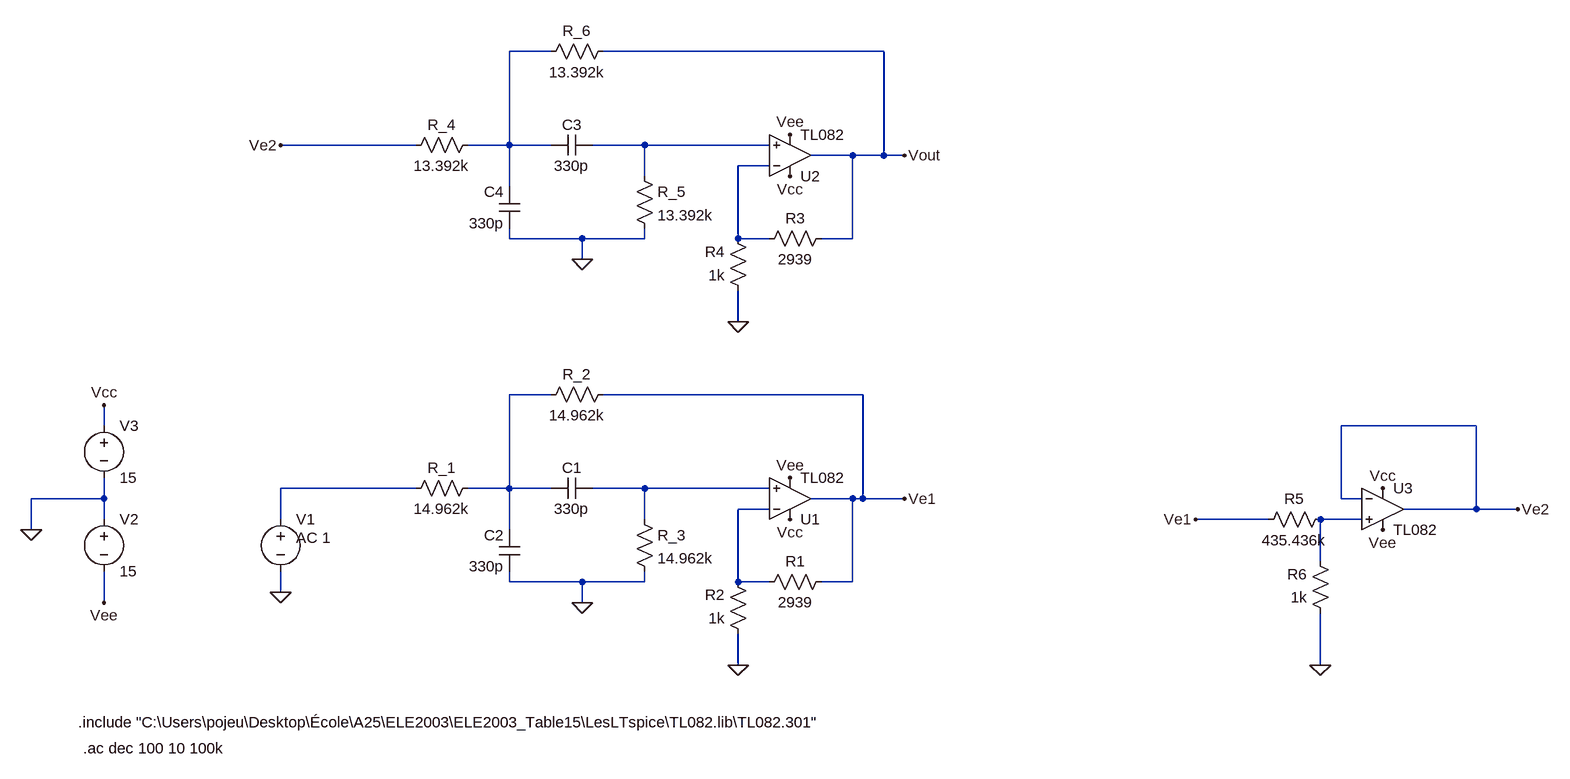
[diagram p0: schematic 2Passe-Bande.asc]
2Passe-Bande.asc, the LTspice schematic file:
Version 4.1
SHEET 1 1836 680
WIRE 288 -800 224 -800
WIRE 800 -800 368 -800
WIRE 80 -656 -128 -656
WIRE 224 -656 224 -800
WIRE 224 -656 160 -656
WIRE 288 -656 224 -656
WIRE 432 -656 352 -656
WIRE 624 -656 432 -656
WIRE 752 -640 688 -640
WIRE 800 -640 800 -800
WIRE 800 -640 752 -640
WIRE 832 -640 800 -640
WIRE 624 -624 576 -624
WIRE 432 -608 432 -656
WIRE 224 -592 224 -656
WIRE 224 -512 224 -528
WIRE 336 -512 224 -512
WIRE 432 -512 432 -528
WIRE 432 -512 336 -512
WIRE 576 -512 576 -624
WIRE 624 -512 576 -512
WIRE 752 -512 752 -640
WIRE 752 -512 704 -512
WIRE 336 -480 336 -512
WIRE 576 -384 576 -432
WIRE 288 -272 224 -272
WIRE 768 -272 368 -272
WIRE -400 -224 -400 -256
WIRE 1712 -224 1504 -224
WIRE 80 -128 -128 -128
WIRE 224 -128 224 -272
WIRE 224 -128 160 -128
WIRE 288 -128 224 -128
WIRE 432 -128 352 -128
WIRE 624 -128 432 -128
WIRE -400 -112 -400 -144
WIRE -400 -112 -512 -112
WIRE 752 -112 688 -112
WIRE 768 -112 768 -272
WIRE 768 -112 752 -112
WIRE 832 -112 768 -112
WIRE 1504 -112 1504 -224
WIRE 1536 -112 1504 -112
WIRE 624 -96 576 -96
WIRE 1712 -96 1712 -224
WIRE 1712 -96 1600 -96
WIRE 1776 -96 1712 -96
WIRE -400 -80 -400 -112
WIRE -128 -80 -128 -128
WIRE 432 -80 432 -128
WIRE 1392 -80 1280 -80
WIRE 1536 -80 1472 -80
WIRE -512 -64 -512 -112
WIRE 224 -64 224 -128
WIRE 1472 -16 1472 -80
WIRE 224 16 224 0
WIRE 336 16 224 16
WIRE 432 16 432 0
WIRE 432 16 336 16
WIRE 576 16 576 -96
WIRE 624 16 576 16
WIRE 752 16 752 -112
WIRE 752 16 704 16
WIRE -128 32 -128 0
WIRE -400 48 -400 0
WIRE 336 48 336 16
WIRE 576 144 576 96
WIRE 1472 144 1472 64
FLAG -128 32 0
FLAG 336 48 0
FLAG 576 144 0
FLAG -512 -64 0
FLAG 656 -144 Vee
FLAG -400 48 Vee
FLAG -400 -256 Vcc
FLAG 656 -80 Vcc
FLAG 336 -480 0
FLAG 576 -384 0
FLAG 656 -672 Vee
FLAG 656 -608 Vcc
FLAG 1472 144 0
FLAG 1568 -64 Vee
FLAG 1568 -128 Vcc
FLAG 832 -640 Vout
FLAG 1280 -80 Ve1
FLAG 1776 -96 Ve2
FLAG -128 -656 Ve2
FLAG 832 -112 Ve1
SYMBOL voltage -128 -96 R0
WINDOW 123 24 44 Left 2
WINDOW 39 0 0 Left 0
SYMATTR InstName V1
SYMATTR Value ""
SYMATTR Value2 AC 1
SYMBOL res 176 -144 R90
WINDOW 0 0 56 VBottom 2
WINDOW 3 32 56 VTop 2
SYMATTR InstName R_1
SYMATTR Value 14.962k
SYMBOL cap 352 -144 R90
WINDOW 0 0 32 VBottom 2
WINDOW 3 32 32 VTop 2
SYMATTR InstName C1
SYMATTR Value 330p
SYMBOL cap 240 0 R180
WINDOW 0 24 56 Left 2
WINDOW 3 24 8 Left 2
SYMATTR InstName C2
SYMATTR Value 330p
SYMBOL res 416 -96 R0
SYMATTR InstName R_3
SYMATTR Value 14.962k
SYMBOL res 384 -288 R90
WINDOW 0 0 56 VBottom 2
WINDOW 3 32 56 VTop 2
SYMATTR InstName R_2
SYMATTR Value 14.962k
SYMBOL OpAmps\\opamp2 656 -48 M180
SYMATTR InstName U1
SYMATTR Value TL082
SYMBOL voltage -400 -96 R0
SYMATTR InstName V2
SYMATTR Value 15
SYMBOL voltage -400 -240 R0
SYMATTR InstName V3
SYMATTR Value 15
SYMBOL res 720 0 R90
WINDOW 0 0 56 VBottom 2
WINDOW 3 32 56 VTop 2
SYMATTR InstName R1
SYMATTR Value 2939
SYMBOL res 592 112 R180
WINDOW 0 36 76 Left 2
WINDOW 3 36 40 Left 2
SYMATTR InstName R2
SYMATTR Value 1k
SYMBOL res 176 -672 R90
WINDOW 0 0 56 VBottom 2
WINDOW 3 32 56 VTop 2
SYMATTR InstName R_4
SYMATTR Value 13.392k
SYMBOL cap 352 -672 R90
WINDOW 0 0 32 VBottom 2
WINDOW 3 32 32 VTop 2
SYMATTR InstName C3
SYMATTR Value 330p
SYMBOL cap 240 -528 R180
WINDOW 0 24 56 Left 2
WINDOW 3 24 8 Left 2
SYMATTR InstName C4
SYMATTR Value 330p
SYMBOL res 416 -624 R0
SYMATTR InstName R_5
SYMATTR Value 13.392k
SYMBOL res 384 -816 R90
WINDOW 0 0 56 VBottom 2
WINDOW 3 32 56 VTop 2
SYMATTR InstName R_6
SYMATTR Value 13.392k
SYMBOL OpAmps\\opamp2 656 -576 M180
SYMATTR InstName U2
SYMATTR Value TL082
SYMBOL res 720 -528 R90
WINDOW 0 0 56 VBottom 2
WINDOW 3 32 56 VTop 2
SYMATTR InstName R3
SYMATTR Value 2939
SYMBOL res 592 -416 R180
WINDOW 0 36 76 Left 2
WINDOW 3 36 40 Left 2
SYMATTR InstName R4
SYMATTR Value 1k
SYMBOL res 1488 -96 R90
WINDOW 0 0 56 VBottom 2
WINDOW 3 32 56 VTop 2
SYMATTR InstName R5
SYMATTR Value 435.436k
SYMBOL res 1488 80 R180
WINDOW 0 36 76 Left 2
WINDOW 3 36 40 Left 2
SYMATTR InstName R6
SYMATTR Value 1k
SYMBOL OpAmps\\opamp2 1568 -160 R0
SYMATTR InstName U3
SYMATTR Value TL082
TEXT -440 232 Left 2 !.include "C:\\Users\\pojeu\\Desktop\\École\\A25\\ELE2003\\ELE2003_Table15\\LesLTspice\\TL082.lib\\TL082.301"
TEXT -432 272 Left 2 !.ac dec 100 10 100k

The netlist it stands for:
* 2Passe-Bande.asc
V1 N005 0 AC 1
R_1 N004 N005 14.962k
C1 N006 N004 330p
C2 0 N004 330p
R_3 N006 0 14.962k
R_2 Ve1 N004 14.962k
X§U1 N006 N007 Vcc Vee Ve1 TL082  ; pins In+ In- V+ V- OUT
V2 0 Vee 15
V3 Vcc 0 15
R1 Ve1 N007 2939
R2 0 N007 1k
R_4 N001 Ve2 13.392k
C3 N002 N001 330p
C4 0 N001 330p
R_5 N002 0 13.392k
R_6 Vout N001 13.392k
X§U2 N002 N003 Vcc Vee Vout TL082  ; pins In+ In- V+ V- OUT
R3 Vout N003 2939
R4 0 N003 1k
R5 N008 Ve1 435.436k
R6 0 N008 1k
X§U3 N008 Ve2 Vcc Vee Ve2 TL082  ; pins In+ In- V+ V- OUT
.include "C:\Users\pojeu\Desktop\École\A25\ELE2003\ELE2003_Table15\LesLTspice\TL082.lib\TL082.301"
.ac dec 100 10 100k
.backanno
.end